# EAGLE design mainboard (EAGLE 7.6.0)
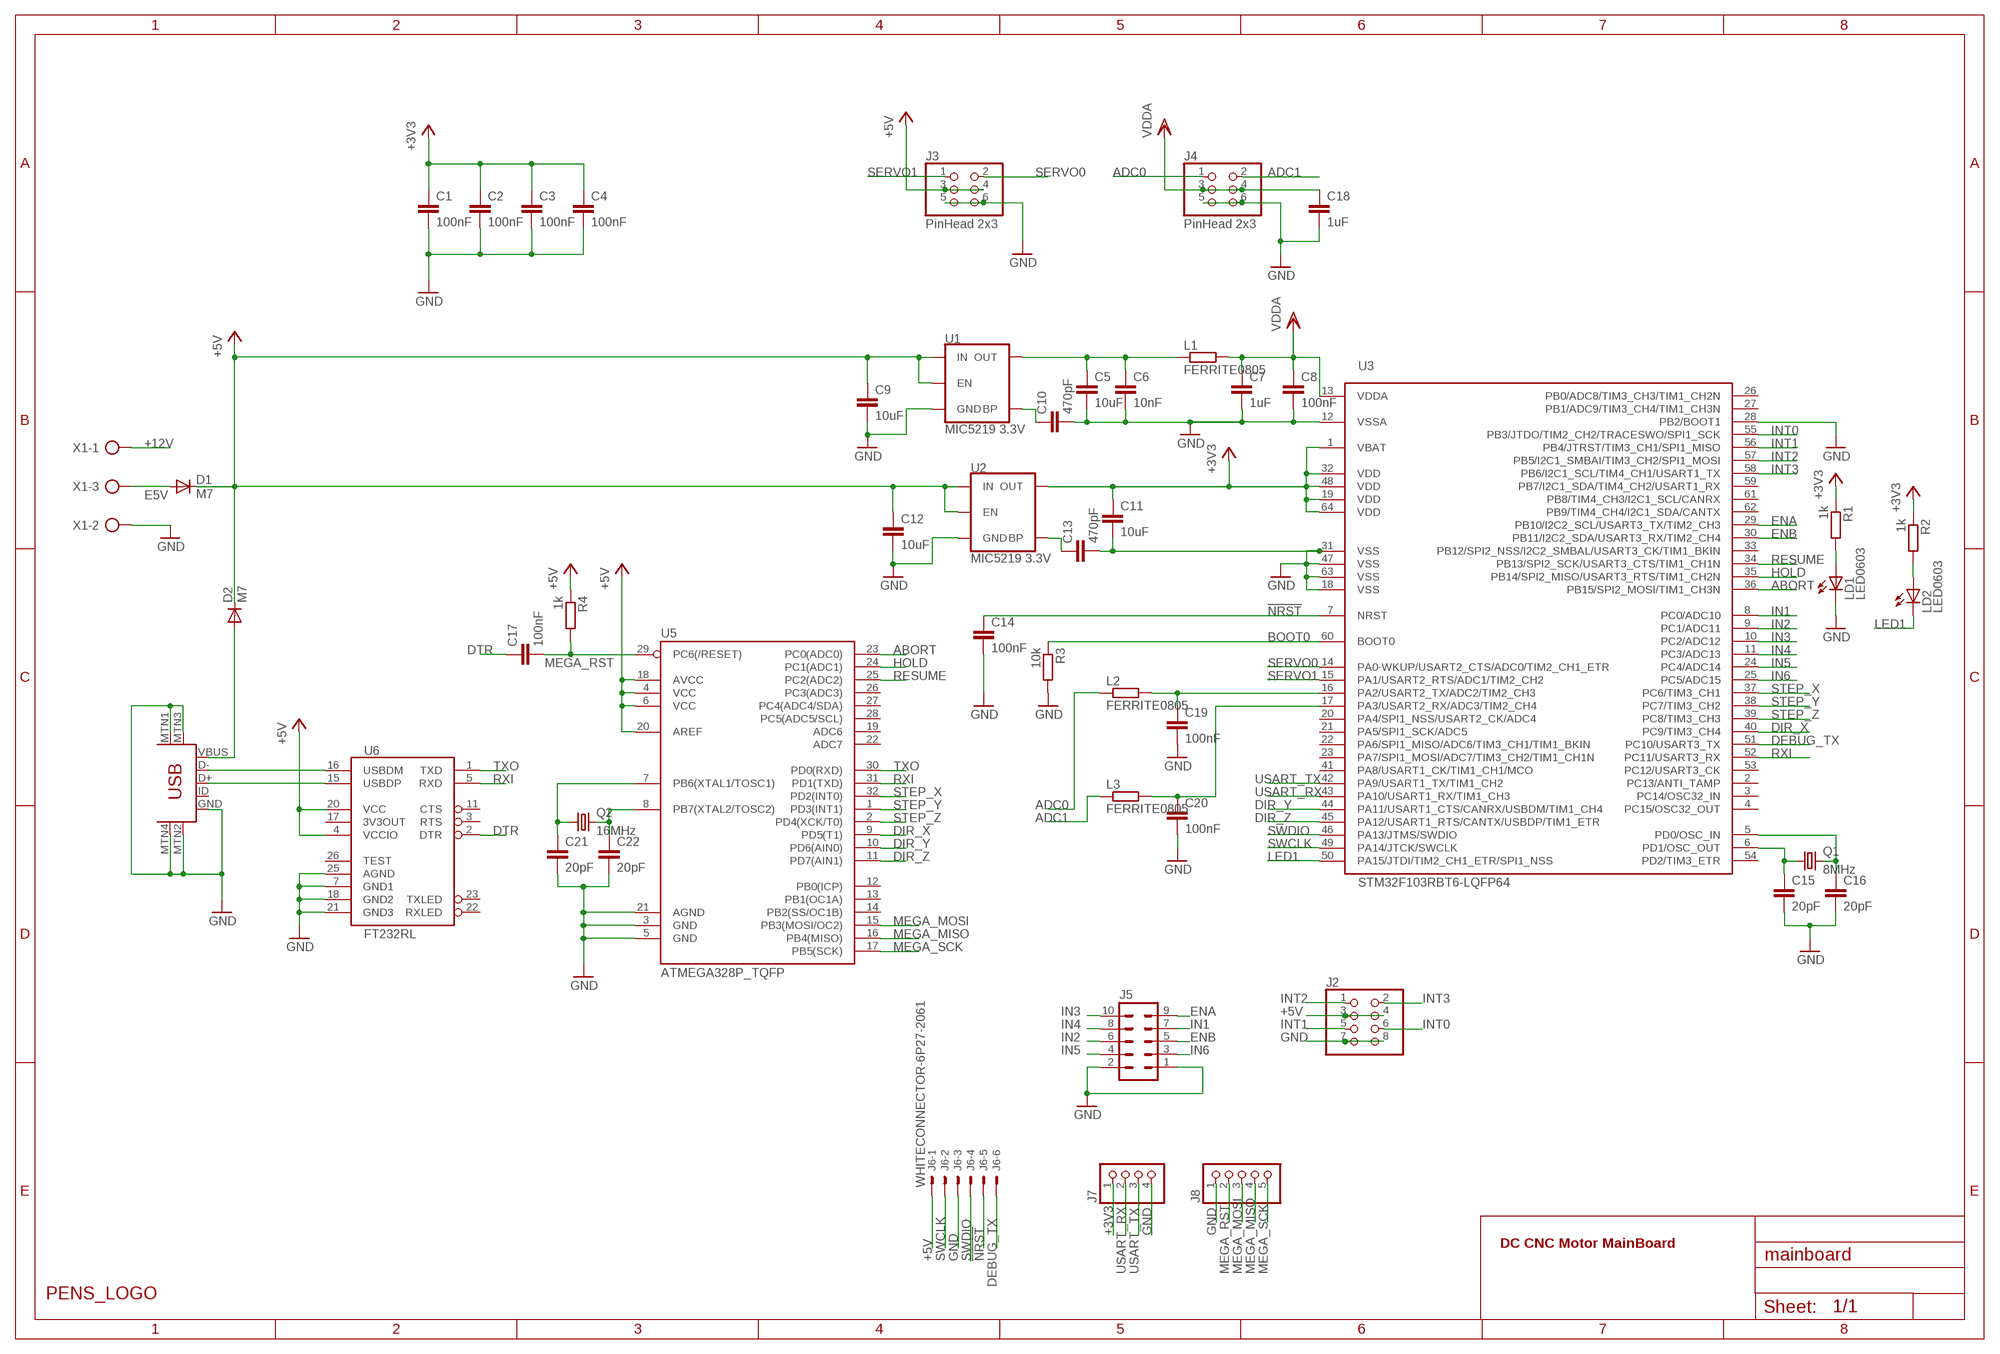
[diagram p0: schematic, sheet 1]

## Parts
C1  100nF  CAP0603  [0603_MP]
C2  100nF  CAP0603  [0603_MP]
C3  100nF  CAP0603  [0603_MP]
C4  100nF  CAP0603  [0603_MP]
C5  10uF  CAP0805  [0805_MP]
C6  10nF  CAP0603  [0603_MP]
C7  1uF  CAP0603  [0603_MP]
C8  100nF  CAP0603  [0603_MP]
C9  10uF  CAP0805  [0805_MP]
C10  470pF  CAP0603  [0603_MP]
C11  10uF  CAP0805  [0805_MP]
C12  10uF  CAP0805  [0805_MP]
C13  470pF  CAP0603  [0603_MP]
C14  100nF  CAP0603  [0603_MP]
C15  20pF  CAP0603  [0603_MP]
C16  20pF  CAP0603  [0603_MP]
C17  100nF  CAP0603  [0603_MP]
C18  1uF  CAP0603  [0603_MP]
C19  100nF  CAP0603  [0603_MP]
C20  100nF  CAP0603  [0603_MP]
C21  20pF  CAP0603  [0603_MP]
C22  20pF  CAP0603  [0603_MP]
D1  M7  DIODESMA  [DIODE_SMA_ALT]
D2  M7  DIODESMA  [DIODE_SMA_ALT]
J1  USB-MINI-B-5PIN  [USB-MINIB]
J2  PINHD-2X4/90  [2X04/90]
J3  PinHead 2x3  PINHD-2X3/90  [2X03/90]
J4  PinHead 2x3  PINHD-2X3/90  [2X03/90]
J5  ML10  [ML10]
J6  WHITECONNECTOR-6P27-2061  [6410-06]
J7  PINHD-1X4  [1X04]
J8  HEADER-1X51.27MM  [1X05_1.27MM]
L1  FERRITE0805  [R0805]
L2  FERRITE0805  [R0805]
L3  FERRITE0805  [R0805]
LD1  LED0603  [LED0603]
LD2  LED0603  [LED0603]
LOGO1  PENS_LOGO  [PENS_LOGO]
Q1  8MHz  CRYSTALDIP  [CRYSTAL-DIP]
Q2  16MHz  CRYSTALDIP  [CRYSTAL-DIP]
R1  1k  RESISTOR0603  [0603_MP]
R2  1k  RESISTOR0603  [0603_MP]
R3  10k  RESISTOR0603  [0603_MP]
R4  1k  RESISTOR0603  [0603_MP]
U1  MIC5219 3.3V  V_REG_MIC52193.3V  [SOT23-5]
U2  MIC5219 3.3V  V_REG_MIC52193.3V  [SOT23-5]
U3  STM32F103RBT6-LQFP64  [LPTQFP64]
U5  ATMEGA328P_TQFP  [TQFP32-08]
U6  FT232RL  FT232RL-BASICSSOP  [SSOP28DB]
X1  AK300/3  [AK300/3]

## Nets
!NRST: C14.1 J6.5 U3.7(NRST)
+3V3: C1.1 C2.1 C3.1 C4.1 C11.1 J7.1 R1.1 R2.1 U2.5(OUT) U3.1(VBAT) U3.19(VDD) U3.32(VDD) U3.48(VDD) U3.64(VDD)
+5V: C9.1 C12.1 D1.C D2.C J2.3 J2.4 J3.3 J3.4 J6.1 R4.1 U1.1(IN) U1.3(EN) U2.1(IN) U2.3(EN) U5.4(VCC) U5.6(VCC) U5.18(AVCC) U5.20(AREF) U6.4(VCCIO) U6.20(VCC)
+12V: X1.1
ABORT: U3.36(PB15/SPI2_MOSI/TIM1_CH3N) U5.23(PC0(ADC0))
ADC0: J4.1 L2.1
ADC1: J4.2 L3.1
BOOT0: R3.1 U3.60(BOOT0)
DEBUG_TX: J6.6 U3.51(PC10/USART3_TX)
DIR_X: U3.40(PC9/TIM3_CH4) U5.9(PD5(T1))
DIR_Y: U3.44(PA11/USART1_CTS/CANRX/USBDM/TIM1_CH4) U5.10(PD6(AIN0))
DIR_Z: U3.45(PA12/USART1_RTS/CANTX/USBDP/TIM1_ETR) U5.11(PD7(AIN1))
DTR: C17.1 U6.2(DTR)
E5V: D1.A X1.3
ENA: J5.9 U3.29(PB10/I2C2_SCL/USART3_TX/TIM2_CH3)
ENB: J5.5 U3.30(PB11/I2C2_SDA/USART3_RX/TIM2_CH4)
GND: C1.2 C2.2 C3.2 C4.2 C5.2 C6.2 C7.2 C8.2 C9.2 C10.2 C11.2 C12.2 C13.2 C14.2 C15.2 C16.2 C18.2 C19.2 C20.2 C21.2 C22.2 J1.GND J1.MTN1(MTN2) J1.MTN2(MTN3) J1.MTN3(MTN1) J1.MTN4 J2.7 J2.8 J3.5 J3.6 J4.5 J4.6 J5.1 J5.2 J6.3 J7.4 J8.1 LD1.C R3.2 U1.2(GND) U2.2(GND) U3.12(VSSA) U3.18(VSS) U3.28(PB2/BOOT1) U3.31(VSS) U3.47(VSS) U3.63(VSS) U5.3(GND) U5.5(GND) U5.21(AGND) U6.7(GND1) U6.18(GND2) U6.21(GND3) U6.25(AGND) X1.2
HOLD: U3.35(PB14/SPI2_MISO/USART3_RTS/TIM1_CH2N) U5.24(PC1(ADC1))
IN1: J5.7 U3.8(PC0/ADC10)
IN2: J5.6 U3.9(PC1/ADC11)
IN3: J5.10 U3.10(PC2/ADC12)
IN4: J5.8 U3.11(PC3/ADC13)
IN5: J5.4 U3.24(PC4/ADC14)
IN6: J5.3 U3.25(PC5/ADC15)
INT0: J2.6 U3.55(PB3/JTDO/TIM2_CH2/TRACESWO/SPI1_SCK)
INT1: J2.5 U3.56(PB4/JTRST/TIM3_CH1/SPI1_MISO)
INT2: J2.1 U3.57(PB5/I2C1_SMBAI/TIM3_CH2/SPI1_MOSI)
INT3: J2.2 U3.58(PB6/I2C1_SCL/TIM4_CH1/USART1_TX)
LED1: LD2.C U3.50(PA15/JTDI/TIM2_CH1_ETR/SPI1_NSS)
MEGA_MISO: J8.4 U5.16(PB4(MISO))
MEGA_MOSI: J8.3 U5.15(PB3(MOSI/OC2))
MEGA_RST: C17.2 J8.2 R4.2 U5.29(PC6(/RESET))
MEGA_SCK: J8.5 U5.17(PB5(SCK))
N$1: J1.D+ U6.15(USBDP)
N$2: J1.D- U6.16(USBDM)
N$3: C19.1 L2.2 U3.16(PA2/USART2_TX/ADC2/TIM2_CH3)
N$4: C20.1 L3.2 U3.17(PA3/USART2_RX/ADC3/TIM2_CH4)
N$5: C15.1 Q1.1 U3.6(PD1/OSC_OUT)
N$6: D2.A J1.VBUS
N$8: C5.1 C6.1 L1.1 U1.5(OUT)
N$9: C21.1 Q2.1 U5.7(PB6(XTAL1/TOSC1))
N$10: C16.1 Q1.2 U3.5(PD0/OSC_IN)
N$11: C10.1 U1.4(BP)
N$12: C22.1 Q2.2 U5.8(PB7(XTAL2/TOSC2))
N$14: LD1.A R1.2
N$15: LD2.A R2.2
N$17: C13.1 U2.4(BP)
RESUME: U3.34(PB13/SPI2_SCK/USART3_CTS/TIM1_CH1N) U5.25(PC2(ADC2))
RXI: U3.52(PC11/USART3_RX) U5.31(PD1(TXD)) U6.5(RXD)
SERVO0: J3.2 U3.14(PA0-WKUP/USART2_CTS/ADC0/TIM2_CH1_ETR)
SERVO1: J3.1 U3.15(PA1/USART2_RTS/ADC1/TIM2_CH2)
STEP_X: U3.37(PC6/TIM3_CH1) U5.32(PD2(INT0))
STEP_Y: U3.38(PC7/TIM3_CH2) U5.1(PD3(INT1))
STEP_Z: U3.39(PC8/TIM3_CH3) U5.2(PD4(XCK/T0))
SWCLK: J6.2 U3.49(PA14/JTCK/SWCLK)
SWDIO: J6.4 U3.46(PA13/JTMS/SWDIO)
TXO: U5.30(PD0(RXD)) U6.1(TXD)
USART_RX: J7.2 U3.43(PA10/USART1_RX/TIM1_CH3)
USART_TX: J7.3 U3.42(PA9/USART1_TX/TIM1_CH2)
VDDA: C7.1 C8.1 C18.1 J4.3 J4.4 L1.2 U3.13(VDDA)
Unconnected: J1.ID U3.2(PC13/ANTI_TAMP) U3.3(PC14/OSC32_IN) U3.4(PC15/OSC32_OUT) U3.20(PA4/SPI1_NSS/USART2_CK/ADC4) U3.21(PA5/SPI1_SCK/ADC5) U3.22(PA6/SPI1_MISO/ADC6/TIM3_CH1/TIM1_BKIN) U3.23(PA7/SPI1_MOSI/ADC7/TIM3_CH2/TIM1_CH1N) U3.26(PB0/ADC8/TIM3_CH3/TIM1_CH2N) U3.27(PB1/ADC9/TIM3_CH4/TIM1_CH3N) U3.33(PB12/SPI2_NSS/I2C2_SMBAL/USART3_CK/TIM1_BKIN) U3.41(PA8/USART1_CK/TIM1_CH1/MCO) U3.53(PC12/USART3_CK) U3.54(PD2/TIM3_ETR) U3.59(PB7/I2C1_SDA/TIM4_CH2/USART1_RX) U3.61(PB8/TIM4_CH3/I2C1_SCL/CANRX) U3.62(PB9/TIM4_CH4/I2C1_SDA/CANTX) U5.12(PB0(ICP)) U5.13(PB1(OC1A)) U5.14(PB2(SS/OC1B)) U5.19(ADC6) U5.22(ADC7) U5.26(PC3(ADC3)) U5.27(PC4(ADC4/SDA)) U5.28(PC5(ADC5/SCL)) U6.3(RTS) U6.11(CTS) U6.17(3V3OUT) U6.22(RXLED) U6.23(TXLED) U6.26(TEST)

## Notes on the sheet
- DC CNC Motor MainBoard

## Library data of the parts
C1-C22 = #afb-Passives:CAP
D1 D2 = #afb-Discretes:DIODE
J1 = #afb-Connectors:USB-MINI-B: Mini-USB "B" connector with 5th pin broken out. Created new symbol breaking out 5th "ID" pin in mini/micro USB connector spec. See: http://en.wikipedia.org/wiki/Mini_usb#Cables. Uses same footprint as 4-pin symbol. Also added pins to connect to mounting / shield pads if required (probably not generally needed as signals aren't shielded once they leave the connector).
J2 = pinhead:PINHD-2X4: PIN HEADER
J3 J4 = pinhead:PINHD-2X3: PIN HEADER
J5 = #afb-Connectors:ML10: HARTING; OC_FARNELL: unknown; OC_NEWARK: unknown
J6 = #afb-Connectors:WHITECONNECTOR-6P: CONNECTOR wire to board 2.54 mm (.1 inch) pitch header
J7 = pinhead:PINHD-1X4: PIN HEADER
J8 = microbuilder:HEADER-1X5: PIN HEADER
L1-L3 = #afb-Passives:FERRITE
LD1 LD2 = #afb-Discretes:LED
LOGO1 = #afb-Aesthetics:PENS_LOGO
Q1 Q2 = #afb-Passives:CRYSTAL
R1-R4 = #afb-Passives:RESISTOR
U1 U2 = SparkFun-IC-Power:V_REG_MIC5219: V_REG MIC5219 Standard 3.3V and 5V 500mA LDO voltage regulator in SOT-23 layout. Micrel part MIC5219. BP (by-pass) pin is used to lower output noise with 470pF cap, may be left open.; PROD_ID: VREG-09872
U3 = #afb-IC:STM32F103RBT6: STM32F103 - Advanced ARM-based 32-bit MCU with Flash, USB, CAN, 8 16-bit timers, 2 ADC, 2 DAC, 11 communication interfaces
U5 = SparkFun-IC-Microcontroller:ATMEGA328P_TQFP: Popular 328P in QFP Storefront component: ATmega328 - TQFP <https://www.sparkfun.com/products/13448> (COM-13448) Datasheet <http://www.sparkfun.com/datasheets/Components/SMD/ATMega328.pdf> SparkFun Products SparkFun RedBoard - Programmed with Arduino <https://www.sparkfun.com/products/12757> (DEV-12757) Arduino Pro Mini 328 - 5V/16MHz <https://www.sparkfun.com/products/11113> (DEV-11113) Arduino Pro Mini 328 - 3.3V/8MHz <https://www.sparkfun.com/products/11114> (DEV-11114) SparkFun OpenLog <https://www.sparkfun.com/products/13712> (DEV-13712) SparkFun MicroView - OLED Arduino Module <https://www.sparkfun.com/products/12923> (DEV-12923) SparkFun Digital Sandbox <https://www.sparkfun.com/products/12651> (DEV-12651) SparkFun PicoBoard <https://www.sparkfun.com/products/11888> (WIG-11888) Arduino Fio <https://www.sparkfun.com/products/10116> (DEV-10116) LilyPad Arduino 328 Main Board <https://www.sparkfun.com/products/13342> (DEV-13342) SparkFun RedStick <https://www.sparkfun.com/products/13741> (DEV-13741) LilyPad MP3 <https://www.sparkfun.com/products/11013> (DEV-11013) LilyPad Arduino SimpleSnap <https://www.sparkfun.com/products/10941> (DEV-10941) SparkFun Stepoko <https://www.sparkfun.com/products/13899> (ROB-13899) SparkFun Geiger Counter <https://www.sparkfun.com/products/11345> (SEN-11345) SparkFun EL Sequencer <https://www.sparkfun.com/products/12781> (COM-12781) Arduino Pro 328 - 5V/16MHz <https://www.sparkfun.com/products/10915> (DEV-10915) CryptoCape <https://www.sparkfun.com/products/12773> (DEV-12773) SparkFun IR Thermometer Evaluation Board - MLX90614 <https://www.sparkfun.com/products/10740> (SEN-10740) SparkFun RedBot Mainboard <https://www.sparkfun.com/products/12097> (ROB-12097) Arduino Pro 328 - 3.3V/8MHz <https://www.sparkfun.com/products/10914> (DEV-10914) SparkFun Block for Intel® Edison - Arduino <https://www.sparkfun.com/products/13036> (DEV-13036) SparkFun Simon Says - Surface Mount Soldering Kit <https://www.sparkfun.com/products/10935> (KIT-10935) SparkFun 7-Segment Serial Display - Red <https://www.sparkfun.com/products/11441> (COM-11441) SparkFun 7-Segment Serial Display - White <https://www.sparkfun.com/products/11629> (COM-11629) SparkFun 7-Segment Serial Display - Yellow <https://www.sparkfun.com/products/11443> (COM-11443) SparkFun 7-Segment Serial Display - Kelly Green <https://www.sparkfun.com/products/11440> (COM-11440) SparkFun 7-Segment Serial Display - Blue <https://www.sparkfun.com/products/11442> (COM-11442) SparkFun OpenSegment Serial Display - 20mm (Blue) <https://www.sparkfun.com/products/11647> (COM-11647) SparkFun OpenSegment Serial Display - 20mm (Green) <https://www.sparkfun.com/products/11646> (COM-11646) SparkFun OpenSegment Serial Display - 20mm (White) <https://www.sparkfun.com/products/11648> (COM-11648) SparkFun OpenSegment Serial Display - 20mm (Red) <https://www.sparkfun.com/products/11644> (COM-11644) SparkFun OpenSegment Serial Display - 20mm (Yellow) <https://www.sparkfun.com/products/11645> (COM-11645) SparkFun OpenSegment Shield <https://www.sparkfun.com/products/13190> (DEV-13190); PROD_ID: IC-09069
U6 = SparkFun-IC-Comms:FT232RL-BASIC: FT232RL USB UART This is the simplified version of the FT232RL unit. Only what you need, nothing you don't. FT232RL 4th Generation USB UART (USB <-> Serial) Controller. Datasheet <http://www.sparkfun.com/datasheets/IC/FT232R_v104.pdf> SparkFun Products Component <https://www.sparkfun.com/products/650> (COM-00650) SparkFun RedBot Mainboard <https://www.sparkfun.com/products/12097> (ROB-12097) SparkFun FTDI Basic Breakout - 5V <https://www.sparkfun.com/products/9716> (DEV-09716) SparkFun FTDI Basic Breakout - 3.3V <https://www.sparkfun.com/products/9873> (DEV-09873) Bus Pirate - v3.6a <https://www.sparkfun.com/products/12942> (TOL-12942) SparkFun USB to Serial Breakout - FT232RL <https://www.sparkfun.com/products/12731> (BOB-12731) SparkFun PicoBoard <https://www.sparkfun.com/products/11888> (WIG-11888) SparkFun RFID USB Reader <https://www.sparkfun.com/products/9963> (SEN-09963) LilyPad FTDI Basic Breakout - 5V <https://www.sparkfun.com/products/10275> (DEV-10275) SparkFun Stepoko <https://www.sparkfun.com/products/13899> (ROB-13899); PROD_ID: IC-00870
X1 = #afb-Connectors:AK300/3: CONNECTOR; OC_FARNELL: unknown; OC_NEWARK: unknown

## Board
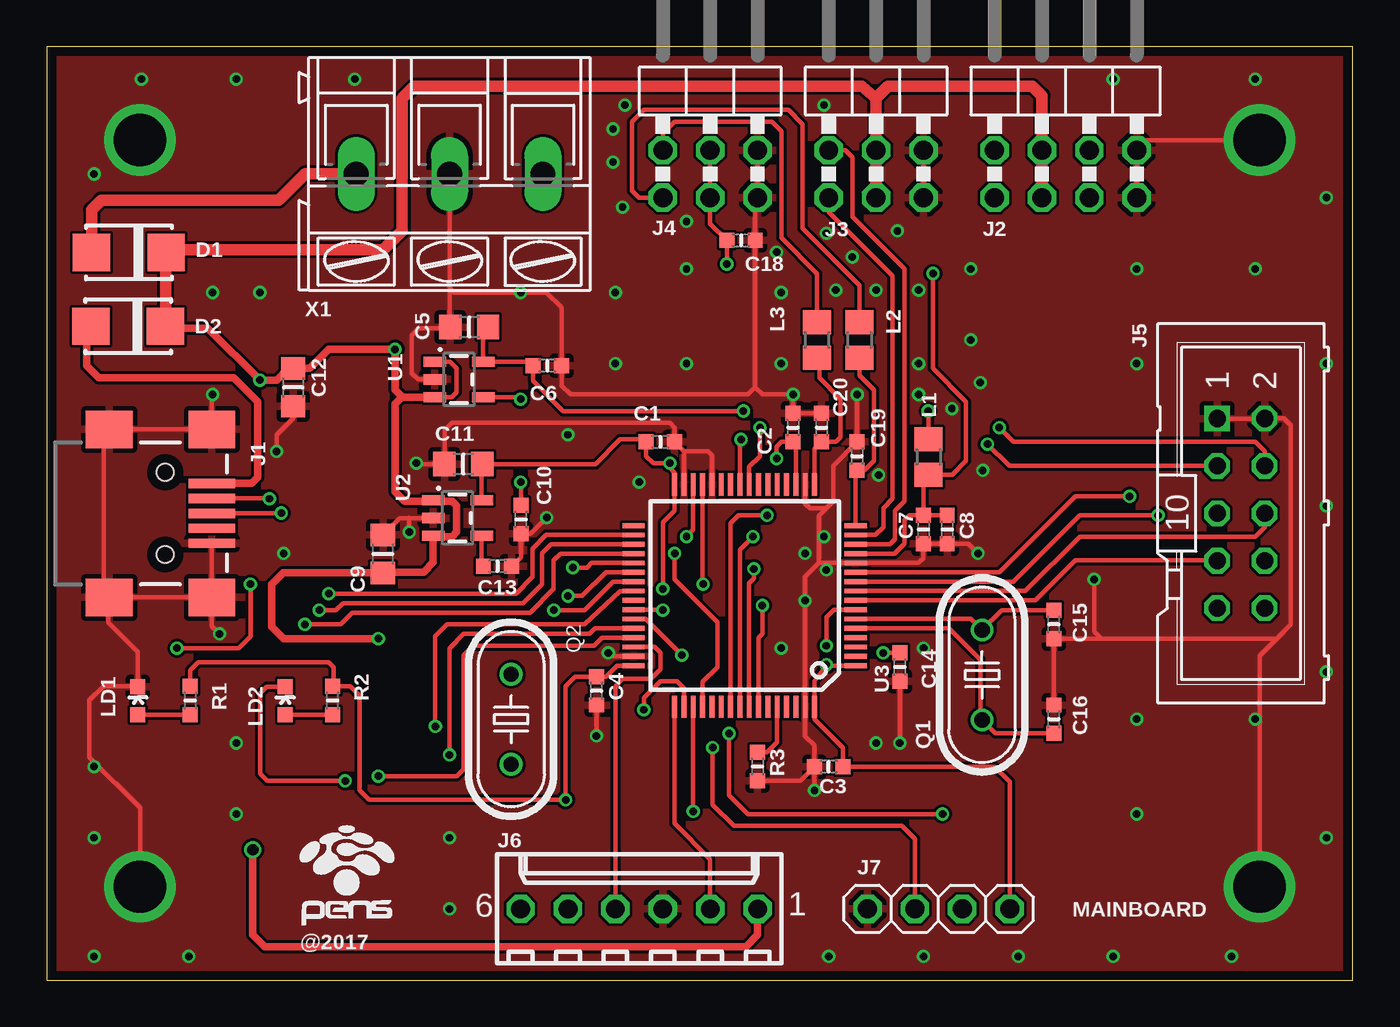
[diagram p1: board, top side]
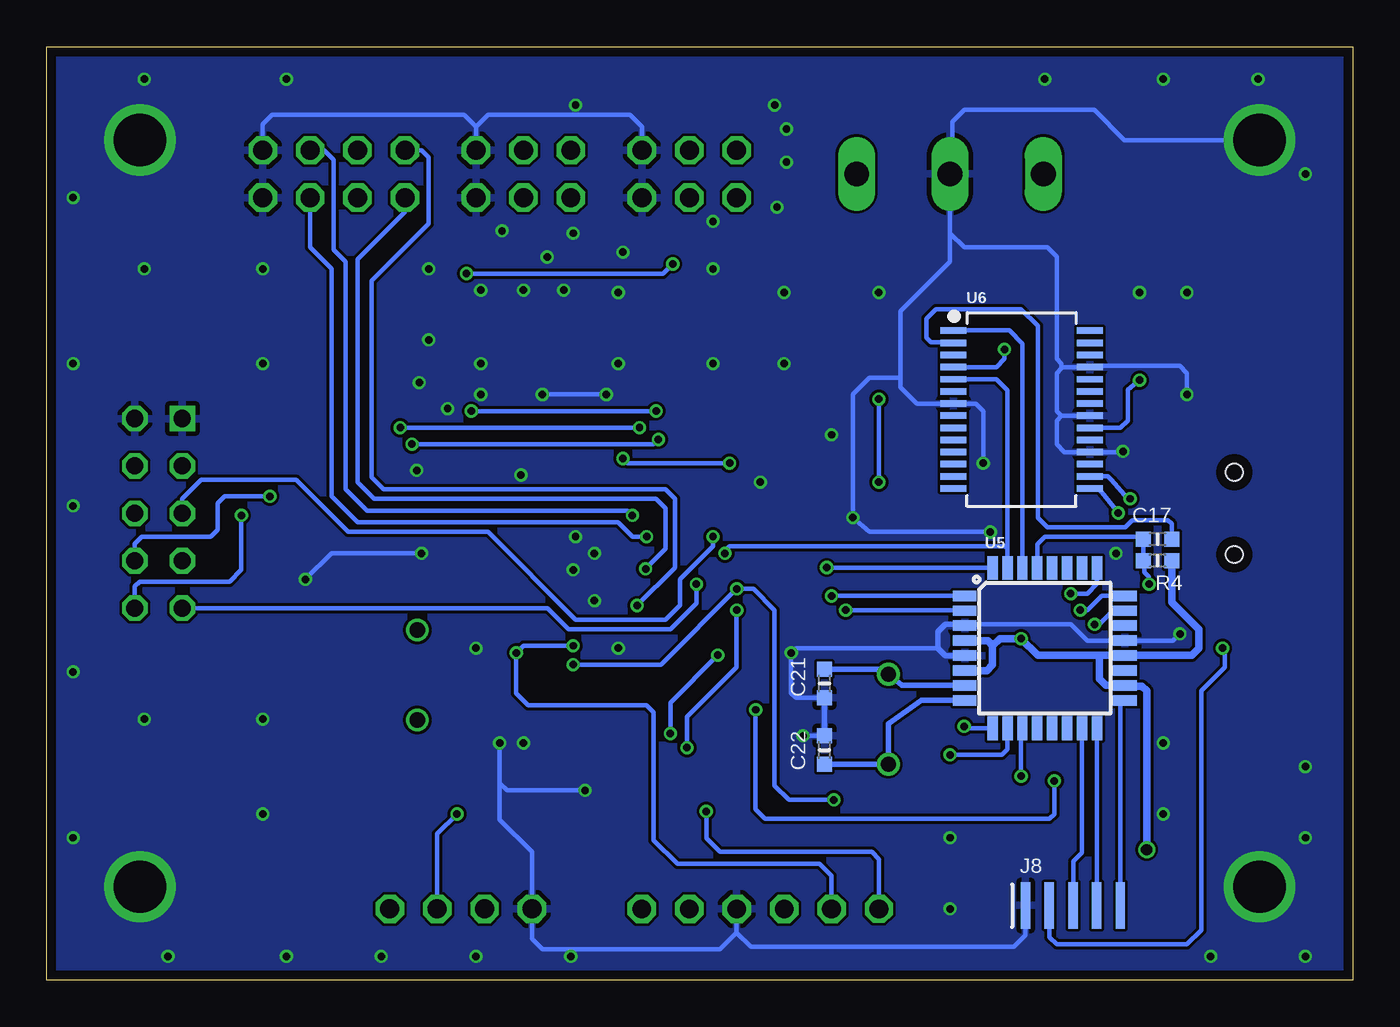
[diagram p2: board, bottom side, seen from below]

Size 70 x 50 mm. Coordinates in mm from the lower left corner, seen from the top.
Outline: 0,0 70,0 70,50 0,50 0,0
Copper layers (1*16): Top 0.035mm / dielectric 1.6mm / Bottom 0.035mm
Design rules "Elecrow_2-layer_PCB_eagle_rule": minimum track width 6mil, minimum drill 12mil, track to track 6mil, track to pad 6mil, pad to pad 6mil, via to via 8mil, smd to smd 0mil, copper to edge 20mil, drill to drill 10mil, minimum pad ring 6mil, minimum via ring 6mil, stop-mask expansion 0mil, vias tented up to drill 100mil, thermal gap 10mil

### Footprints (pad centres in the part's own frame; a part is rotated, then mirrored left to right if it is on the bottom)
0603_MP = smd 0.8 x 0.8: 1 -0.762,0; 2 0.762,0
0805_MP = smd 1.2 x 1.3: 1 -1.016,0; 2 1.016,0
DIODE_SMA_ALT = smd 2 x 2: A -2,0; C 2,0
USB-MINIB = smd 2.5 x 0.5: D+ 2.5,0; D- 2.5,0.8; GND 2.5,-1.6; ID 2.5,-0.8; VBUS 2.5,1.6 | smd 2.5 x 2: MTN1 -3,4.5; MTN2 2.5,4.5; MTN3 -3,-4.5; MTN4 2.5,-4.5 | hole 0.9: 0,2.2; 0,-2.2
2X04/90 = drill 1.016 octagon: 1 -3.81,-6.35; 2 -3.81,-3.81; 3 -1.27,-6.35; 4 -1.27,-3.81; 5 1.27,-6.35; 6 1.27,-3.81; 7 3.81,-6.35; 8 3.81,-3.81
2X03/90 = drill 1.016 octagon: 1 -2.54,-6.35; 2 -2.54,-3.81; 3 0,-6.35; 4 0,-3.81; 5 2.54,-6.35; 6 2.54,-3.81
ML10 = drill 0.914 square: 1 -5.08,-1.27 | drill 0.914 octagon: 2 -5.08,1.27; 3 -2.54,-1.27; 4 -2.54,1.27; 5 0,-1.27; 6 0,1.27; 7 2.54,-1.27; 8 2.54,1.27; 9 5.08,-1.27; 10 5.08,1.27
6410-06 = drill 1 pad 1.524 octagon: 1 6.35,0; 2 3.81,0; 3 1.27,0; 4 -1.27,0; 5 -3.81,0 | drill 1 octagon: 6 -6.35,0
1X04 = drill 1.016 octagon: 1 -3.81,0; 2 -1.27,0; 3 1.27,0; 4 3.81,0
1X05_1.27MM = smd 0.5 x 2.5: 1 -2.54,0; 2 -1.27,0; 3 0,0; 4 1.27,0; 5 2.54,0
R0805 = smd 1.3 x 1.5: 1 -0.95,0; 2 0.95,0
LED0603 = smd 0.8 x 0.8: A 0,-0.75; C 0,0.75
CRYSTAL-DIP = drill 0.813: 1 -2.413,0; 2 2.413,0
SOT23-5 = smd 0.55 x 1.2: 1 -0.95,-1.3; 2 0,-1.3; 3 0.95,-1.3; 4 0.95,1.3; 5 -0.95,1.3
LPTQFP64 = smd 0.254 x 1.2: 1 -3.75,-5.95; 2 -3.25,-5.95; 3 -2.75,-5.95; 4 -2.25,-5.95; 5 -1.75,-5.95; 6 -1.25,-5.95; 7 -0.75,-5.95; 8 -0.25,-5.95; 9 0.25,-5.95; 10 0.75,-5.95; 11 1.25,-5.95; 12 1.75,-5.95; 13 2.25,-5.95; 14 2.75,-5.95; 15 3.25,-5.95; 16 3.75,-5.95; 33 3.75,5.95; 34 3.25,5.95; 35 2.75,5.95; 36 2.25,5.95; 37 1.75,5.95; 38 1.25,5.95; 39 0.75,5.95; 40 0.25,5.95; 41 -0.25,5.95; 42 -0.75,5.95; 43 -1.25,5.95; 44 -1.75,5.95; 45 -2.25,5.95; 46 -2.75,5.95; 47 -3.25,5.95; 48 -3.75,5.95 | smd 1.2 x 0.254: 17 5.95,-3.75; 18 5.95,-3.25; 19 5.95,-2.75; 20 5.95,-2.25; 21 5.95,-1.75; 22 5.95,-1.25; 23 5.95,-0.75; 24 5.95,-0.25; 25 5.95,0.25; 26 5.95,0.75; 27 5.95,1.25; 28 5.95,1.75; 29 5.95,2.25; 30 5.95,2.75; 31 5.95,3.25; 32 5.95,3.75; 49 -5.95,3.75; 50 -5.95,3.25; 51 -5.95,2.75; 52 -5.95,2.25; 53 -5.95,1.75; 54 -5.95,1.25; 55 -5.95,0.75; 56 -5.95,0.25; 57 -5.95,-0.25; 58 -5.95,-0.75; 59 -5.95,-1.25; 60 -5.95,-1.75; 61 -5.95,-2.25; 62 -5.95,-2.75; 63 -5.95,-3.25; 64 -5.95,-3.75
TQFP32-08 = smd 1.27 x 0.559: 1 -4.293,2.8; 2 -4.293,2; 3 -4.293,1.2; 4 -4.293,0.4; 5 -4.293,-0.4; 6 -4.293,-1.2; 7 -4.293,-2; 8 -4.293,-2.8; 17 4.293,-2.8; 18 4.293,-2; 19 4.293,-1.2; 20 4.293,-0.4; 21 4.293,0.4; 22 4.293,1.2; 23 4.293,2; 24 4.293,2.8 | smd 0.559 x 1.27: 9 -2.8,-4.293; 10 -2,-4.293; 11 -1.2,-4.293; 12 -0.4,-4.293; 13 0.4,-4.293; 14 1.2,-4.293; 15 2,-4.293; 16 2.8,-4.293; 25 2.8,4.293; 26 2,4.293; 27 1.2,4.293; 28 0.4,4.293; 29 -0.4,4.293; 30 -1.2,4.293; 31 -2,4.293; 32 -2.8,4.293
SSOP28DB = smd 0.348 x 1.397: 1 -4.225,-3.656; 2 -3.575,-3.656; 3 -2.925,-3.656; 4 -2.275,-3.656; 5 -1.625,-3.656; 6 -0.975,-3.656; 7 -0.325,-3.656; 8 0.325,-3.656; 9 0.975,-3.656; 10 1.625,-3.656; 11 2.275,-3.656; 12 2.925,-3.656; 13 3.575,-3.656; 14 4.225,-3.656; 15 4.225,3.656; 16 3.575,3.656; 17 2.925,3.656; 18 2.275,3.656; 19 1.625,3.656; 20 0.975,3.656; 21 0.325,3.656; 22 -0.325,3.656; 23 -0.975,3.656; 24 -1.625,3.656; 25 -2.275,3.656; 26 -2.925,3.656; 27 -3.575,3.656; 28 -4.225,3.656
AK300/3 = drill 1.321 long: 1 -5.004,0; 2 0,0; 3 5.004,0

### Placement (x,y rotation side)
C1  32.89,28.83 0 top
C2  40.01,29.59 90 top
C3  41.91,11.43 180 top
C4  29.46,15.49 270 top
C5  22.64,34.98 180 top
C6  26.83,32.91 0 top
C7  46.99,24.13 270 top
C8  48.26,24.13 270 top
C9  18.02,22.83 90 top
C10  25.41,24.67 270 top
C11  22.33,27.64 180 top
C12  13.21,31.75 270 top
C13  24.16,22.17 0 top
C14  45.72,16.76 270 top
C15  53.98,19.05 270 top
C16  53.98,13.97 90 top
C17  10.46,23.62 180 bottom
C18  37.21,39.62 0 top
C19  43.43,28.07 90 top
C20  41.53,29.59 90 top
C21  28.32,15.88 270 bottom
C22  28.32,12.32 90 bottom
D1  4.41,38.98 0 top
D2  4.37,35.02 0 top
J1  6.35,25 0 top
J2  54.61,48.26 0 top
J3  44.45,48.26 0 top
J4  35.56,48.26 0 top
J5  64,25 270 top
J6  31.75,3.81 0 top
J7  47.8,3.81 180 top
J8  15,4 0 bottom
L1  47.26,28.02 270 top
L2  43.56,34.29 270 top
L3  41.27,34.29 270 top
LD1  4.89,14.97 0 top
LD2  12.78,14.97 0 top
LOGO1  13.56,2.92 0 top
Q1  50.13,16.34 270 top
Q2  24.89,13.97 270 top
R1  7.7,14.97 270 top
R2  15.32,14.97 270 top
R3  38.1,11.43 270 top
R4  10.46,22.46 180 bottom
U1  22.1,32.17 270 top
U2  22.02,24.75 270 top
U3  37.4,20.59 90 top
U5  16.51,17.78 0 bottom
U6  17.76,30.56 270 bottom
X1  21.59,43.18 180 top

### Tracks (layer width: path | path; a pad name or v marks a point on that pad's centre or on a via)
!NRST  (via drill 0.4)
  Top 0.254: U3.7 42.19,19.84 41.78,19.43 v41.78,17.91 | v44.83,17.53 C14.1
  Bottom 0.254: v41.78,17.91 44.45,17.91 v44.83,17.53 44.83,15.37 44.2,14.73 37.85,14.73 37.47,14.35 37.47,7.49 36.2,6.22 28.57,6.22 27.94,5.59 J6.5
+3V3  (via drill 0.4)
  Top 0.254: U3.48 30.56,16.84 29.97,16.26 C4.1 28.32,16.26 27.81,15.75 v27.81,9.65 17.27,9.65 16.76,10.16 16.76,15.24 16.26,15.75 15.34,15.75 R2.1 15.37,15.78 15.37,16.76 15.11,17.02 8.13,17.02 7.7,16.59 R1.1 | J7.1 51.61,10.62 50.8,11.43 C3.1 42.67,12.45 41.15,13.97 U3.64 41.15,16 v41.78,16.89 41.86,16.84 U3.1 | U2.5 23.32,27.61 C11.1 29.42,27.64 30.73,28.96 32,28.96 C1.1 32.13,28.07 32.51,27.69 v33.4,27.69 33.4,27.43 33.66,27.18 U3.32 | U3.32 | U3.32 33.65,25.14 33.02,24.51 v33.02,20.95 | 40.15,27.67 U3.19 40.15,28.68 C2.1 39.37,28.83 39.12,28.57 v39.12,27.94
  Bottom 0.254: v27.81,9.65 30.23,9.65 30.99,10.41 30.99,19.81 32.13,20.95 v33.02,20.95 37.08,16.89 v41.78,16.89 | v33.4,27.69 38.86,27.69 v39.12,27.94
+5V  (via drill 0.4, 0.6)
  Top 0.254: 6.33,34.92 D2.C | 6.37,38.81 D1.C 6.55,39.12 | 18.05,21.84 C9.1 | U1.1 21.62,33.12 21.97,32.77 21.97,31.5 21.7,31.22 U1.3 19.07,31.22 | 20.67,25.65 U2.1 | 20.77,23.75 U2.3
  Top 0.406: 6.33,34.92 8.64,34.92 v11.43,32.13 12.32,32.13 12.95,32.77 C12.1 14.1,32.77 15.11,33.78 v18.67,33.78 18.67,31.62 19.07,31.22 | U2.3 20.72,22.37 20.19,21.84 18.05,21.84 | U1.3 19.03,31.22 18.67,30.86 18.67,26.16 19.18,25.65 20.67,25.65 21.72,25.65 21.97,25.4 21.97,24 21.72,23.75 20.77,23.75 | C9.1 12.67,21.81 12.06,21.21 12.06,18.92 12.7,18.29 v17.78,18.29 | J6.1 38.1,2.41 37.47,1.78 11.68,1.78 11.05,2.41 v11.05,6.99
  Top 0.61: D2.C 6.37,38.81 | J3.3 J3.4 44.45,47.24 | 44.45,47.24 43.69,47.88 19.68,47.88 19.05,47.24 19.05,40.13 18.03,39.12 6.55,39.12 | J2.3 J2.4 53.34,47.37 52.83,47.88 45.09,47.88 44.45,47.24
  Bottom 0.254: 12.24,17.4 U5.20 12.2,17.4 | U6.4 19.11,32.83 18.67,33.27 v18.67,33.78 | U6.20 12.45,29.58 12.06,29.97 12.06,31.62 v11.43,32.13 | 12.19,15.75 U5.18
  Bottom 0.305: 20.78,18.16 U5.4
  Bottom 0.406: U5.6 19.61,16.58 19.3,16.89 19.3,17.91 | 19.3,17.91 19.56,18.16 20.78,18.16 | 19.3,17.91 18.92,18.29 v17.78,18.29 16.89,17.4 13.59,17.4 | 13.59,17.4 12.24,17.4 | U5.18 13.24,15.78 13.59,16.13 13.59,17.4 | R4.1 9.7,20.24 8.26,18.8 8.26,17.78 8.64,17.4 12.2,17.4 | v11.05,6.99 11.05,15.49 11.3,15.75 12.19,15.75
ABORT  (via drill 0.4)
  Top 0.254: U3.36 27.54,22.84 27.18,22.48 27.18,20.95 25.91,19.68 16.38,19.68 15.75,19.05 v13.84,19.05
  Bottom 0.254: v13.84,19.05 13.59,19.05 12.83,19.81 12.25,19.81 U5.23
ADC0
  Top 0.254: L2.1 43.56,37.21 40.51,40.26 40.51,45.85 39.75,46.61 32,46.61 31.37,45.97 31.37,42.29 31.75,41.91 J4.1
ADC1
  Top 0.254: L3.1 41.27,37.85 39.37,39.75 39.37,45.47 38.86,45.97 33.66,45.97 33.02,45.34 J4.2
BOOT0
  Top 0.254: R3.1 38.61,12.19 39.15,12.73 U3.60
DEBUG_TX  (via drill 0.4)
  Top 0.254: U3.51 v34.65,9.04 34.67,9.02
  Bottom 0.254: v34.65,9.04 34.65,7.6 33.91,6.86 25.78,6.86 25.4,6.48 J6.6
DIR_X  (via drill 0.4)
  Top 0.254: v20.83,13.59 20.83,18.41 21.46,19.05 28.83,19.05 30.73,20.83 31.44,20.83 U3.40
  Bottom 0.254: U5.9 20.73,13.49 v20.83,13.59
DIR_Y  (via drill 0.4)
  Top 0.254: v21.59,12.06 21.59,17.78 22.35,18.54 29.08,18.54 29.38,18.84 U3.44
  Bottom 0.254: U5.10 18.51,12.35 18.8,12.06 v21.59,12.06
DIR_Z  (via drill 0.4)
  Top 0.254: U3.45 29.77,18.34 29.34,17.91 22.86,17.91 22.35,17.4 22.35,11.3 21.97,10.92 v17.78,10.92
  Bottom 0.254: v17.78,10.92 17.78,13.42 U5.11
DTR
  Bottom 0.254: C17.1 9.7,24.43 9.91,24.64 11.81,24.64 12.19,24.26 16.38,24.26 16.89,24.77 16.89,35.05 17.78,35.94 22.35,35.94 22.86,35.43 22.86,34.42 22.61,34.16 21.44,34.16 U6.2
E5V
  Top 0.254: D1.A
  Top 0.61: X1.3 13.84,43.18 12.45,41.78 2.92,41.78 2.41,41.27 D1.A
ENA  (via drill 0.4)
  Top 0.254: U3.29 35.15,21.24 v35.18,21.21
  Bottom 0.254: J5.9 43.16,19.92 42.04,18.8 36.58,18.8 35.18,20.19 v35.18,21.21
ENB  (via drill 0.4)
  Top 0.254: U3.30 34.65,24.11 v34.29,23.75
  Bottom 0.254: J5.5 62.73,25.79 61.72,26.8 56.64,26.8 53.85,24 46.35,24 41.66,19.3 36.83,19.3 36.07,20.07 36.07,21.46 34.29,23.24 v34.29,23.75
GND  (via drill 0.4, 2.8)
  Top 0.254: J1.MTN2 J1.MTN1 | J1.MTN2 3.21,29.5 3.05,29.34 3.05,20.8 J1.MTN3 | J1.MTN3 J1.MTN4 | J1.MTN4 J1.GND | J1.MTN4 8.85,18.96 v9.27,18.54 | J1.MTN3 3.3,20.45 3.3,19.18 4.89,17.59 LD1.C 4.86,15.75 3.05,15.75 2.29,14.99 2.29,11.94 5,9.22 v5,5 | C16.2 C15.2 56.52,18.29 | R3.2 40.39,10.67 C3.2 | C3.2 41.15,12.57 40.65,13.07 U3.63 40.65,21.6 41.39,22.34 | 62.33,30.48 J5.1 J5.2 65.29,30.1 66.29,30.1 66.67,29.72 66.67,19.05 65.91,18.29 | C20.2 C2.2 v40.01,31.37 38.35,31.37 37.97,31.75 | U3.18 40.65,25.52 40.89,25.27 41.78,25.27 | 41.78,25.27 42.16,25.65 42.16,27.56 C19.2 v43.43,31.37 | 37.97,31.75 C18.2 37.97,41.78 J4.5 J4.6 | C4.2 v29.46,13.08 | 41.39,22.34 U3.12 46.72,22.34 46.99,22.61 C7.2 C8.2 49.4,23.37 v49.91,22.86 | 56.52,18.29 65.91,18.29 | C13.2 25.41,22.66 C10.2 25.94,23.91 v26.8,24.77 | U3.31 34.15,28.33 | X1.2 21.59,37.08 | 21.59,37.08 21.59,35.01 C5.2 21.57,34.92 19.94,34.92 19.56,34.54 19.56,32.51 19.9,32.17 U1.2 | v19.81,27.69 19.86,27.64 C11.2 21.34,27.66 21.34,29.46 21.72,29.84 33.4,29.84 33.66,29.59 C1.2 34.15,28.33 | C9.2 18.92,24.75 U2.2 19.45,24.75 19.43,24.77 v19.43,24 | J1.MTN2 8.85,31.33 v8.89,31.37 | C12.2 13.21,30.1 12.32,29.21 v12.32,28.32 | 21.59,37.08 21.84,36.83 26.8,36.83 27.59,36.03 C6.2 27.59,31.84 28.07,31.37 37.59,31.37 37.97,31.75 | C14.2 v45.72,12.7 | J3.5 J3.6 | J2.7 J2.8 58.97,45 v65,45 | 30.23,17.4 v30.1,17.53 30.29,17.34 U3.47 | v56.13,21.46 56.13,18.67 56.52,18.29 | 41.39,22.34 41.39,24.88 41.78,25.27 | U3.28 35.65,28.1 35.43,28.32 34.16,28.32 34.15,28.33 | C3.2 v41.15,10.16 | v65,5 65,17.38 65.91,18.29
  Bottom 0.254: 15.62,32.77 15.55,32.83 U6.25 14.04,32.89 9.27,32.89 8.89,32.51 v8.89,31.37 | J8.1 17.54,2.4 18.16,1.78 32.26,1.78 33.02,2.54 | 33.02,2.54 J6.3 | 33.02,2.54 33.91,1.65 43.43,1.65 43.99,2.21 J7.4 43.99,6.86 45.72,8.59 45.72,10.54 | v43.43,31.37 43.43,31.11 43.18,31.37 v40.01,31.37 | v29.46,13.08 C22.2 | v19.81,27.69 19.81,30.48 20.19,30.86 21.39,30.86 | 21.39,30.86 U6.7 | v12.32,28.32 12.36,28.28 U6.18 15.46,28.28 15.88,28.7 15.88,29.97 15.62,30.23 U6.21 15.63,30.23 15.88,30.48 15.88,32.51 15.62,32.77 | v45.72,12.7 45.72,10.54 | v9.27,18.54 9.65,18.16 12.2,18.16 U5.21 12.24,18.16 14.22,18.16 15.11,19.05 21.84,19.05 | 15.62,32.77 15.62,33.02 15.88,33.27 15.88,38.73 16.38,39.24 20.83,39.24 21.59,40.01 | 21.59,40.01 X1.2 21.46,43.31 21.46,45.97 20.83,46.61 13.84,46.61 12.23,45 v5,45 | 21.39,30.86 23.37,30.86 24.26,31.75 24.26,32.26 | 24.26,32.26 24.26,35.81 21.59,38.48 21.59,40.01 | 24.26,32.26 25.91,32.26 26.8,31.37 v26.8,24.77 25.91,24 v19.43,24 | 22.23,17.78 29.84,17.78 v30.1,17.53 30.1,15.37 29.84,15.11 C21.2 | J2.8 58.42,45.85 57.91,46.35 47.62,46.35 46.99,45.72 | J3.6 46.99,45.72 | 46.99,45.72 46.35,46.35 38.73,46.35 38.1,45.72 J4.6 | v49.91,22.86 54.74,22.86 v56.13,21.46 | v41.15,10.16 45.34,10.16 45.72,10.54
  Bottom 0.305: C22.2 C21.2 | U5.5 21.82,17.38 22.23,17.78 22.23,18.67 21.84,19.05 20.87,19.05 U5.3
  other vias: 2.54,11.43 2.54,7.62 2.54,1.27 7.62,1.27 41.91,1.27 46.99,1.27 52.07,1.27 57.15,1.27 63.5,1.27 68.58,7.62 68.58,16.51 68.58,25.4 68.58,33.02 68.58,41.91 64.77,48.26 64.77,38.1 58.42,38.1 58.42,33.02 49.53,38.1 49.53,34.29 34.29,40.64 34.29,38.1 39.37,36.83 39.37,33.02 34.29,33.02 30.48,33.02 30.48,36.83 25.4,36.83 27.94,29.21 31.75,26.67 40.64,22.86 40.64,20.32 39.37,17.78 44.45,12.7 21.59,7.62 21.59,3.81 10.16,12.7 10.16,8.89 11.43,36.83 8.89,36.83 16.51,48.26 10.16,48.26 5.08,48.26 57.15,48.26 58.42,13.97 64.77,13.97 58.42,8.89 42.29,36.96 41.78,40.01 43.18,38.73 39.12,38.99 30.35,45.59 30.99,46.86 30.35,43.81 30.86,41.4 41.66,46.86 46.74,31.37 50.04,32 50.16,27.3 48.51,30.61 41.66,23.75 41.78,21.97 2.54,43.18 12.7,22.86 46.99,17.78 46.74,36.96 46.74,33.02 45.59,40.13 44.45,36.96 44.58,27.05
  pour Bottom: 0,50.8 69.85,50.8 69.85,0 0,0
  pour Top: 0,50.8 69.85,50.8 69.85,0 0,0
HOLD  (via drill 0.4)
  Top 0.254: U3.35 27.02,23.34 26.54,22.86 26.54,21.21 25.53,20.19 15.88,20.19 15.49,19.81 v14.61,19.81
  Bottom 0.254: U5.24 13.46,20.58 14.22,19.81 v14.61,19.81
IN1
  Top 0.254: U3.8 52.98,20.34 55.12,22.48 62.71,22.48 J5.7
IN2
  Top 0.254: U3.9 52.46,20.84 55.37,23.75 64.77,23.75 65.28,24.26 J5.6
IN3  (via drill 0.4)
  Top 0.254: U3.10 51.82,21.34 55.37,24.89 v59.56,24.89
  Bottom 0.254: v59.56,24.89 59.56,21.97 60.2,21.34 65.02,21.34 65.28,21.08 J5.10
IN4  (via drill 0.4)
  Top 0.254: U3.11 51.05,21.84 55.12,25.91 v58.04,25.91
  Bottom 0.254: v58.04,25.91 60.45,25.91 60.83,25.53 60.83,24.13 61.21,23.75 64.9,23.75 65.28,23.37 J5.8
IN5  (via drill 0.4)
  Top 0.254: U3.24 37.65,27.49 38.23,28.07 v38.23,29.59 | J5.4 65.27,28.33 64.77,28.83 51.82,28.83 v51.05,29.59
  Bottom 0.254: v38.23,29.59 v51.05,29.59
IN6  (via drill 0.4)
  Top 0.254: J5.3 51.58,27.54 v50.42,28.7 | U3.25 37.15,28.89 v37.21,28.96
  Bottom 0.254: v50.42,28.7 37.47,28.7 v37.21,28.96
INT0  (via drill 0.4)
  Top 0.254: U3.55 36.65,24.46 37.08,24.89 v38.61,24.89
  Bottom 0.254: J2.6 55.12,44.45 54.61,43.94 54.61,39.12 53.98,38.48 53.98,26.29 52.83,25.15 38.86,25.15 v38.61,24.89
INT1  (via drill 0.4)
  Top 0.254: U3.56 37.15,23.05 v37.85,23.75
  Bottom 0.254: J2.5 55.88,39.24 54.74,38.1 54.74,25.91 53.34,24.51 39.37,24.51 38.61,23.75 v37.85,23.75
INT2  (via drill 0.4)
  Top 0.254: U3.57 37.65,21.27 37.9,21.52 v37.9,22.03
  Bottom 0.254: J2.1 50.8,41.15 53.34,38.61 53.34,26.67 52.45,25.78 37.34,25.78 36.83,25.27 36.83,23.1 v37.9,22.03
INT3  (via drill 0.4)
  Top 0.254: U3.58 38.15,18.34 38.35,18.54 v38.35,20.07
  Bottom 0.254: J2.2 49.91,44.45 49.53,44.07 49.53,40.51 52.58,37.47 52.58,26.92 51.94,26.29 36.83,26.29 36.32,25.78 36.32,22.1 v38.35,20.07
LED1  (via drill 0.4)
  Top 0.254: 12.16,15.72 LD2.C 11.78,15.72 11.43,15.37 11.43,11.05 11.81,10.67 v16,10.67 | U3.50 34.15,15.63 33.78,16 32.89,16 32,15.11 v32,14.48
  Bottom 0.254: v16,10.67 16,8.89 16.26,8.64 31.5,8.64 32,9.14 v32,14.48
MEGA_MISO
  Bottom 0.254: J8.4 13.73,13.47 U5.16
MEGA_MOSI
  Bottom 0.254: U5.15 14.51,6.83 14.99,6.35 14.99,4.01 J8.3
MEGA_RST  (via drill 0.4)
  Top 0.254: v6.99,17.78 10.29,17.78 10.92,18.41 v10.92,21.21
  Bottom 0.254: U5.29 16.91,23.35 16.51,23.75 11.35,23.75 C17.2 | C17.2 R4.2 11.18,22.41 11.18,21.84 10.92,21.59 v10.92,21.21 | J8.2 16.27,2.3 15.88,1.91 8.89,1.91 8.13,2.67 8.13,15.49 6.86,16.76 6.86,17.65 v6.99,17.78 | 11.3,23.7 C17.2
MEGA_SCK
  Bottom 0.254: J8.5 12.46,14.74 U5.17
N$1  (via drill 0.4)
  Top 0.254: J1.D+ 12.55,25 v12.57,25.02
  Bottom 0.254: v12.57,25.02 13.59,26.29 U6.15
N$2  (via drill 0.4)
  Top 0.254: J1.D- 11.92,25.8 v11.94,25.78
  Bottom 0.254: U6.16 13.14,26.98 12.95,26.8 12.06,25.78 v11.94,25.78
N$3
  Top 0.254: U3.16 43.35,27.22 C19.1 43.81,27.3 44.32,27.81 44.32,31.62 43.56,32.38 L2.2
N$4
  Top 0.254: U3.17 41.15,28.45 C20.1 42.29,28.83 42.55,29.08 42.55,31.11 41.4,32.26 41.4,33.21 L3.2
N$5
  Top 0.254: U3.6 49.54,19.34 Q1.1 51.19,19.81 C15.1
N$6
  Top 0.254: 2.16,34.94 D2.A
  Top 0.406: J1.VBUS 10.98,26.6 11.3,26.92 11.3,30.99 10.03,32.26 2.79,32.26 2.16,32.89 2.16,34.94
N$8  (via drill 0.4)
  Top 0.254: C5.1 23.4,34.72 U1.5 25.86,33.12 C6.1 26.07,32.1 27.69,30.48 v37.34,30.48 | v47.24,30.48 47.24,28.99 L1.1
  Bottom 0.254: v37.34,30.48 v47.24,30.48
N$9
  Bottom 0.305: C21.1 25.27,16.64 Q2.1 24.16,15.78 U5.7
N$10
  Top 0.254: U3.5 48.34,18.84 50.04,17.14 50.04,14.02 Q1.2 50.85,13.21 C16.1
N$11  (via drill 0.4)
  Top 0.254: C10.1 25.41,26.66 v25.4,26.67 | U1.4 25.3,31.22 v25.4,31.11
  Bottom 0.254: v25.4,26.67 25.4,30.61 v25.4,31.11
N$12
  Bottom 0.305: U5.8 23.12,14.98 24.89,13.72 Q2.2 C22.1
N$14
  Top 0.254: R1.2 4.9,14.21 LD1.A
N$15
  Top 0.254: LD2.A 15.31,14.22 R2.2
N$17
  Top 0.254: U2.4 23.32,22.25 C13.1
RESUME  (via drill 0.4)
  Top 0.254: U3.34 26.76,23.84 26.04,23.11 26.04,21.59 25.15,20.7 v15.11,20.7
  Bottom 0.254: v15.11,20.7 14.22,20.7 13.71,21.21 U5.25
RXI  (via drill 0.4)
  Top 0.254: U3.52 35.15,15.97 35.94,16.76 35.94,19.18 33.66,21.46 v33.66,22.86
  Bottom 0.254: U5.31 18.51,23.11 | 18.51,23.11 18.51,31.59 19.1,32.18 U6.5 | v33.66,22.86 33.66,22.99 33.4,23.24 18.64,23.24 18.51,23.11
SERVO0
  Top 0.254: U3.14 45.18,23.34 45.47,23.62 45.47,25.15 45.97,25.65 45.97,38.1 43.18,40.89 43.18,44.07 42.8,44.45 J3.2
SERVO1
  Top 0.254: J3.1 41.91,41.15 45.34,37.72 45.34,25.78 44.83,25.27 44.83,24.26 44.41,23.84 U3.15
STEP_X  (via drill 0.4)
  Top 0.254: U3.37 29.22,22.34 29.21,22.35 28.96,22.1 v28.19,22.1
  Bottom 0.254: U5.32 28.17,22.07 v28.19,22.1
STEP_Y  (via drill 0.4)
  Top 0.254: U3.38 29.97,21.84 28.7,20.57 v27.94,20.57
  Bottom 0.254: v27.94,20.57 U5.1
STEP_Z  (via drill 0.4)
  Top 0.254: U3.39 30.36,21.34 28.83,19.81 v27.18,19.81
  Bottom 0.254: v27.18,19.81 20.84,19.81 U5.2
SWCLK
  Top 0.254: U3.49 33.65,8.39 35.56,6.48 J6.2
SWDIO
  Top 0.254: J6.4 30.48,15.75 30.86,16.13 32.38,16.13 32.89,16.64 32.89,17.53 32.58,17.84 U3.46
TXO
  Bottom 0.254: U5.30 17.71,34.09 18.41,34.8 21.4,34.8 U6.1
USART_RX  (via drill 0.4)
  Top 0.254: v48.01,8.89 37.59,8.89 36.58,9.91 36.58,12.7 v36.58,13.21 | U3.43 32.09,19.34 v34.04,17.4
  Bottom 0.254: J7.2 49.07,7.83 v48.01,8.89 | v34.04,17.4 36.58,14.86 v36.58,13.21
USART_TX  (via drill 0.4)
  Top 0.254: J7.3 46.53,7.57 45.85,8.26 36.83,8.26 35.69,9.4 v35.69,12.45 | U3.42 32.87,19.84 v33.02,19.81
  Bottom 0.254: v35.69,12.45 35.69,14.1 33.02,16.76 v33.02,19.81
VDDA  (via drill 0.4)
  Top 0.254: U3.13 45.45,22.84 45.97,23.37 45.97,24.64 46.23,24.89 C7.1 | C8.1 C7.1 | C7.1 46.99,26.8 L1.2 | J4.4 J4.3 35.56,40.51 C18.1 v36.45,38.35 | 47.28,27.05 L1.2 | L1.2 48.53,27.07 49.28,27.81 49.28,30.99 47.5,32.77 v47.5,37.85
  Bottom 0.254: v47.5,37.85 36.96,37.85 v36.45,38.35

### Text on the board
tNames: MAINBOARD | @2017